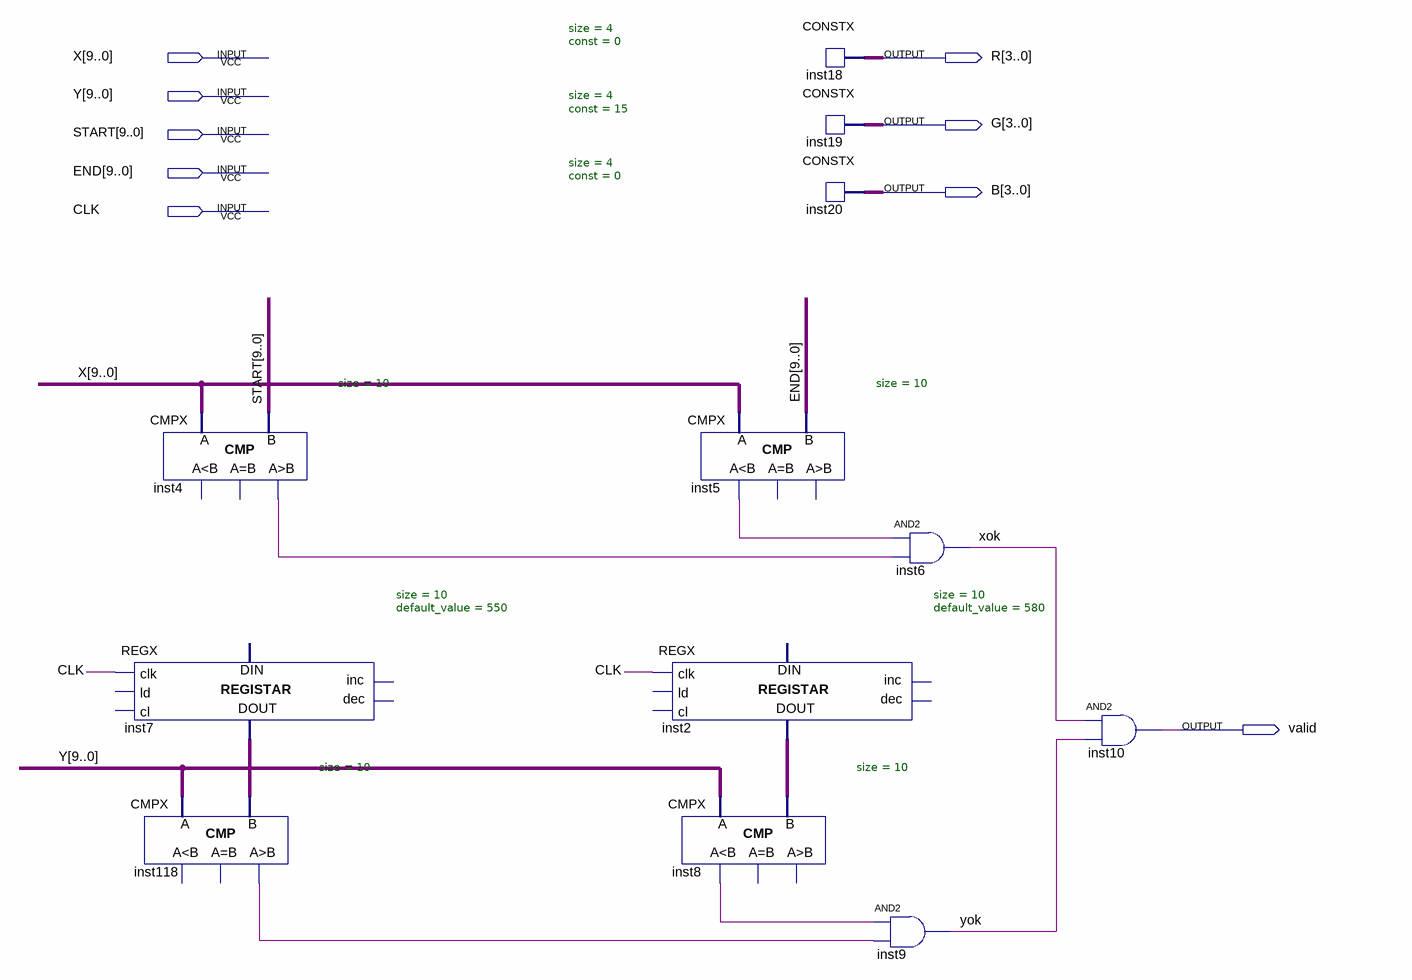
[diagram p0: schematic sheet]
// Quartus schematic Layer1.bdf as structural Verilog: 12 symbols, 9 pins
module Layer1 (
  input  [9:0] X,
  input  [9:0] Y,
  input  [9:0] START,
  input  [9:0] END,
  input  CLK,
  output [3:0] R,
  output [3:0] G,
  output [3:0] B,
  output valid
);

  wire inst4_gr, inst5_ls, inst8_ls, inst118_gr, xok, yok;
  wire [9:0] inst2_data_out, inst7_data_out;

  CMPX #(.size(10)) inst4 (.A(X), .B(START), .gr(inst4_gr));  // open: ls, eq
  REGX #(.size(10), .default_value(550)) inst7 (
    .clk(CLK), .data_out(inst7_data_out));  // open: ld, cl, inc, dec, data_in
  CMPX #(.size(10)) inst118 (.A(Y), .B(inst7_data_out), .gr(inst118_gr));  // open: ls, eq
  CMPX #(.size(10)) inst5 (.A(X), .B(END), .ls(inst5_ls));  // open: eq, gr
  REGX #(.size(10), .default_value(580)) inst2 (
    .clk(CLK), .data_out(inst2_data_out));  // open: ld, cl, inc, dec, data_in
  CMPX #(.size(10)) inst8 (.A(Y), .B(inst2_data_out), .ls(inst8_ls));  // open: eq, gr
  CONSTX #(.size(4), .\const (0)) inst18 (.data(R));
  CONSTX #(.size(4), .\const (15)) inst19 (.data(G));
  CONSTX #(.size(4), .\const (0)) inst20 (.data(B));
  and inst6 (xok, inst5_ls, inst4_gr);
  and inst9 (yok, inst8_ls, inst118_gr);
  and inst10 (valid, xok, yok);
endmodule
